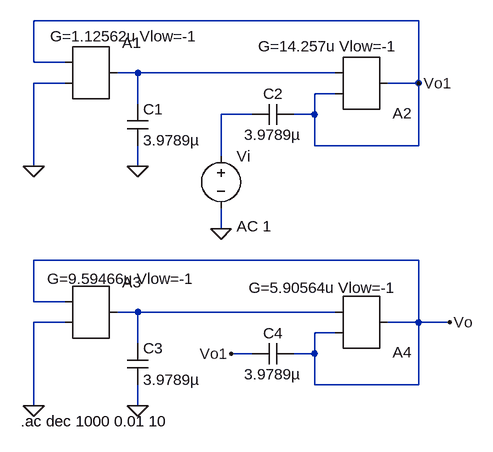
[diagram p0: schematic Ej_8.asc]
Ej_8.asc, the LTspice schematic file:
Version 4
SHEET 1 880 680
WIRE 608 -16 16 -16
WIRE 16 48 16 -16
WIRE 64 48 16 48
WIRE 176 64 144 64
WIRE 480 64 176 64
WIRE 64 80 16 80
WIRE 608 80 608 -16
WIRE 608 80 560 80
WIRE 480 96 448 96
WIRE 176 112 176 64
WIRE 352 128 304 128
WIRE 448 128 448 96
WIRE 448 128 416 128
WIRE 448 176 448 128
WIRE 608 176 608 80
WIRE 608 176 448 176
WIRE 304 192 304 128
WIRE 16 208 16 80
WIRE 176 208 176 176
WIRE 304 304 304 272
WIRE 608 352 16 352
WIRE 16 416 16 352
WIRE 64 416 16 416
WIRE 176 432 144 432
WIRE 480 432 176 432
WIRE 64 448 16 448
WIRE 608 448 608 352
WIRE 608 448 560 448
WIRE 656 448 608 448
WIRE 480 464 448 464
WIRE 176 480 176 432
WIRE 352 496 320 496
WIRE 448 496 448 464
WIRE 448 496 416 496
WIRE 448 544 448 496
WIRE 608 544 608 448
WIRE 608 544 448 544
WIRE 16 576 16 448
WIRE 176 576 176 544
FLAG 176 208 0
FLAG 304 304 0
FLAG 16 208 0
FLAG 176 576 0
FLAG 16 576 0
FLAG 608 80 Vo1
FLAG 320 496 Vo1
FLAG 656 448 Vo
SYMBOL voltage 304 176 R0
WINDOW 123 24 124 Left 2
WINDOW 39 0 0 Left 0
SYMATTR InstName Vi
SYMATTR Value ""
SYMATTR Value2 AC 1
SYMBOL SpecialFunctions\\ota 96 0 R0
WINDOW 3 -55 8 Left 2
SYMATTR InstName A1
SYMATTR Value G=1.12562u Vlow=-1
SYMBOL SpecialFunctions\\ota 512 144 M180
WINDOW 3 -151 121 Left 2
SYMATTR InstName A2
SYMATTR Value G=14.257u Vlow=-1
SYMBOL cap 160 112 R0
SYMATTR InstName C1
SYMATTR Value 3.9789µ
SYMBOL cap 416 112 R90
WINDOW 0 0 32 VBottom 2
WINDOW 3 32 32 VTop 2
SYMATTR InstName C2
SYMATTR Value 3.9789µ
SYMBOL SpecialFunctions\\ota 96 368 R0
WINDOW 3 -59 13 Left 2
SYMATTR InstName A3
SYMATTR Value G=9.59466u Vlow=-1
SYMBOL SpecialFunctions\\ota 512 512 M180
WINDOW 3 -165 117 Left 2
SYMATTR InstName A4
SYMATTR Value G=5.90564u Vlow=-1
SYMBOL cap 160 480 R0
SYMATTR InstName C3
SYMATTR Value 3.9789µ
SYMBOL cap 416 480 R90
WINDOW 0 0 32 VBottom 2
WINDOW 3 32 32 VTop 2
SYMATTR InstName C4
SYMATTR Value 3.9789µ
TEXT -4 600 Left 2 !.ac dec 1000 0.01 10

The netlist it stands for:
* Ej_8.asc
Vi N002 0 AC 1
A1 Vo1 0 0 0 0 0 N001 0 OTA G=1.12562u Vlow=-1
A2 Vo1 N001 0 0 0 0 Vo1 0 OTA G=14.257u Vlow=-1
C1 N001 0 3.9789µ
C2 Vo1 N002 3.9789µ
A3 Vo 0 0 0 0 0 N003 0 OTA G=9.59466u Vlow=-1
A4 Vo N003 0 0 0 0 Vo 0 OTA G=5.90564u Vlow=-1
C3 N003 0 3.9789µ
C4 Vo Vo1 3.9789µ
.ac dec 1000 0.01 10
.backanno
.end